# Altium project ArDINo SSR OUTPUT OPTICAL INPUT.PrjPCB
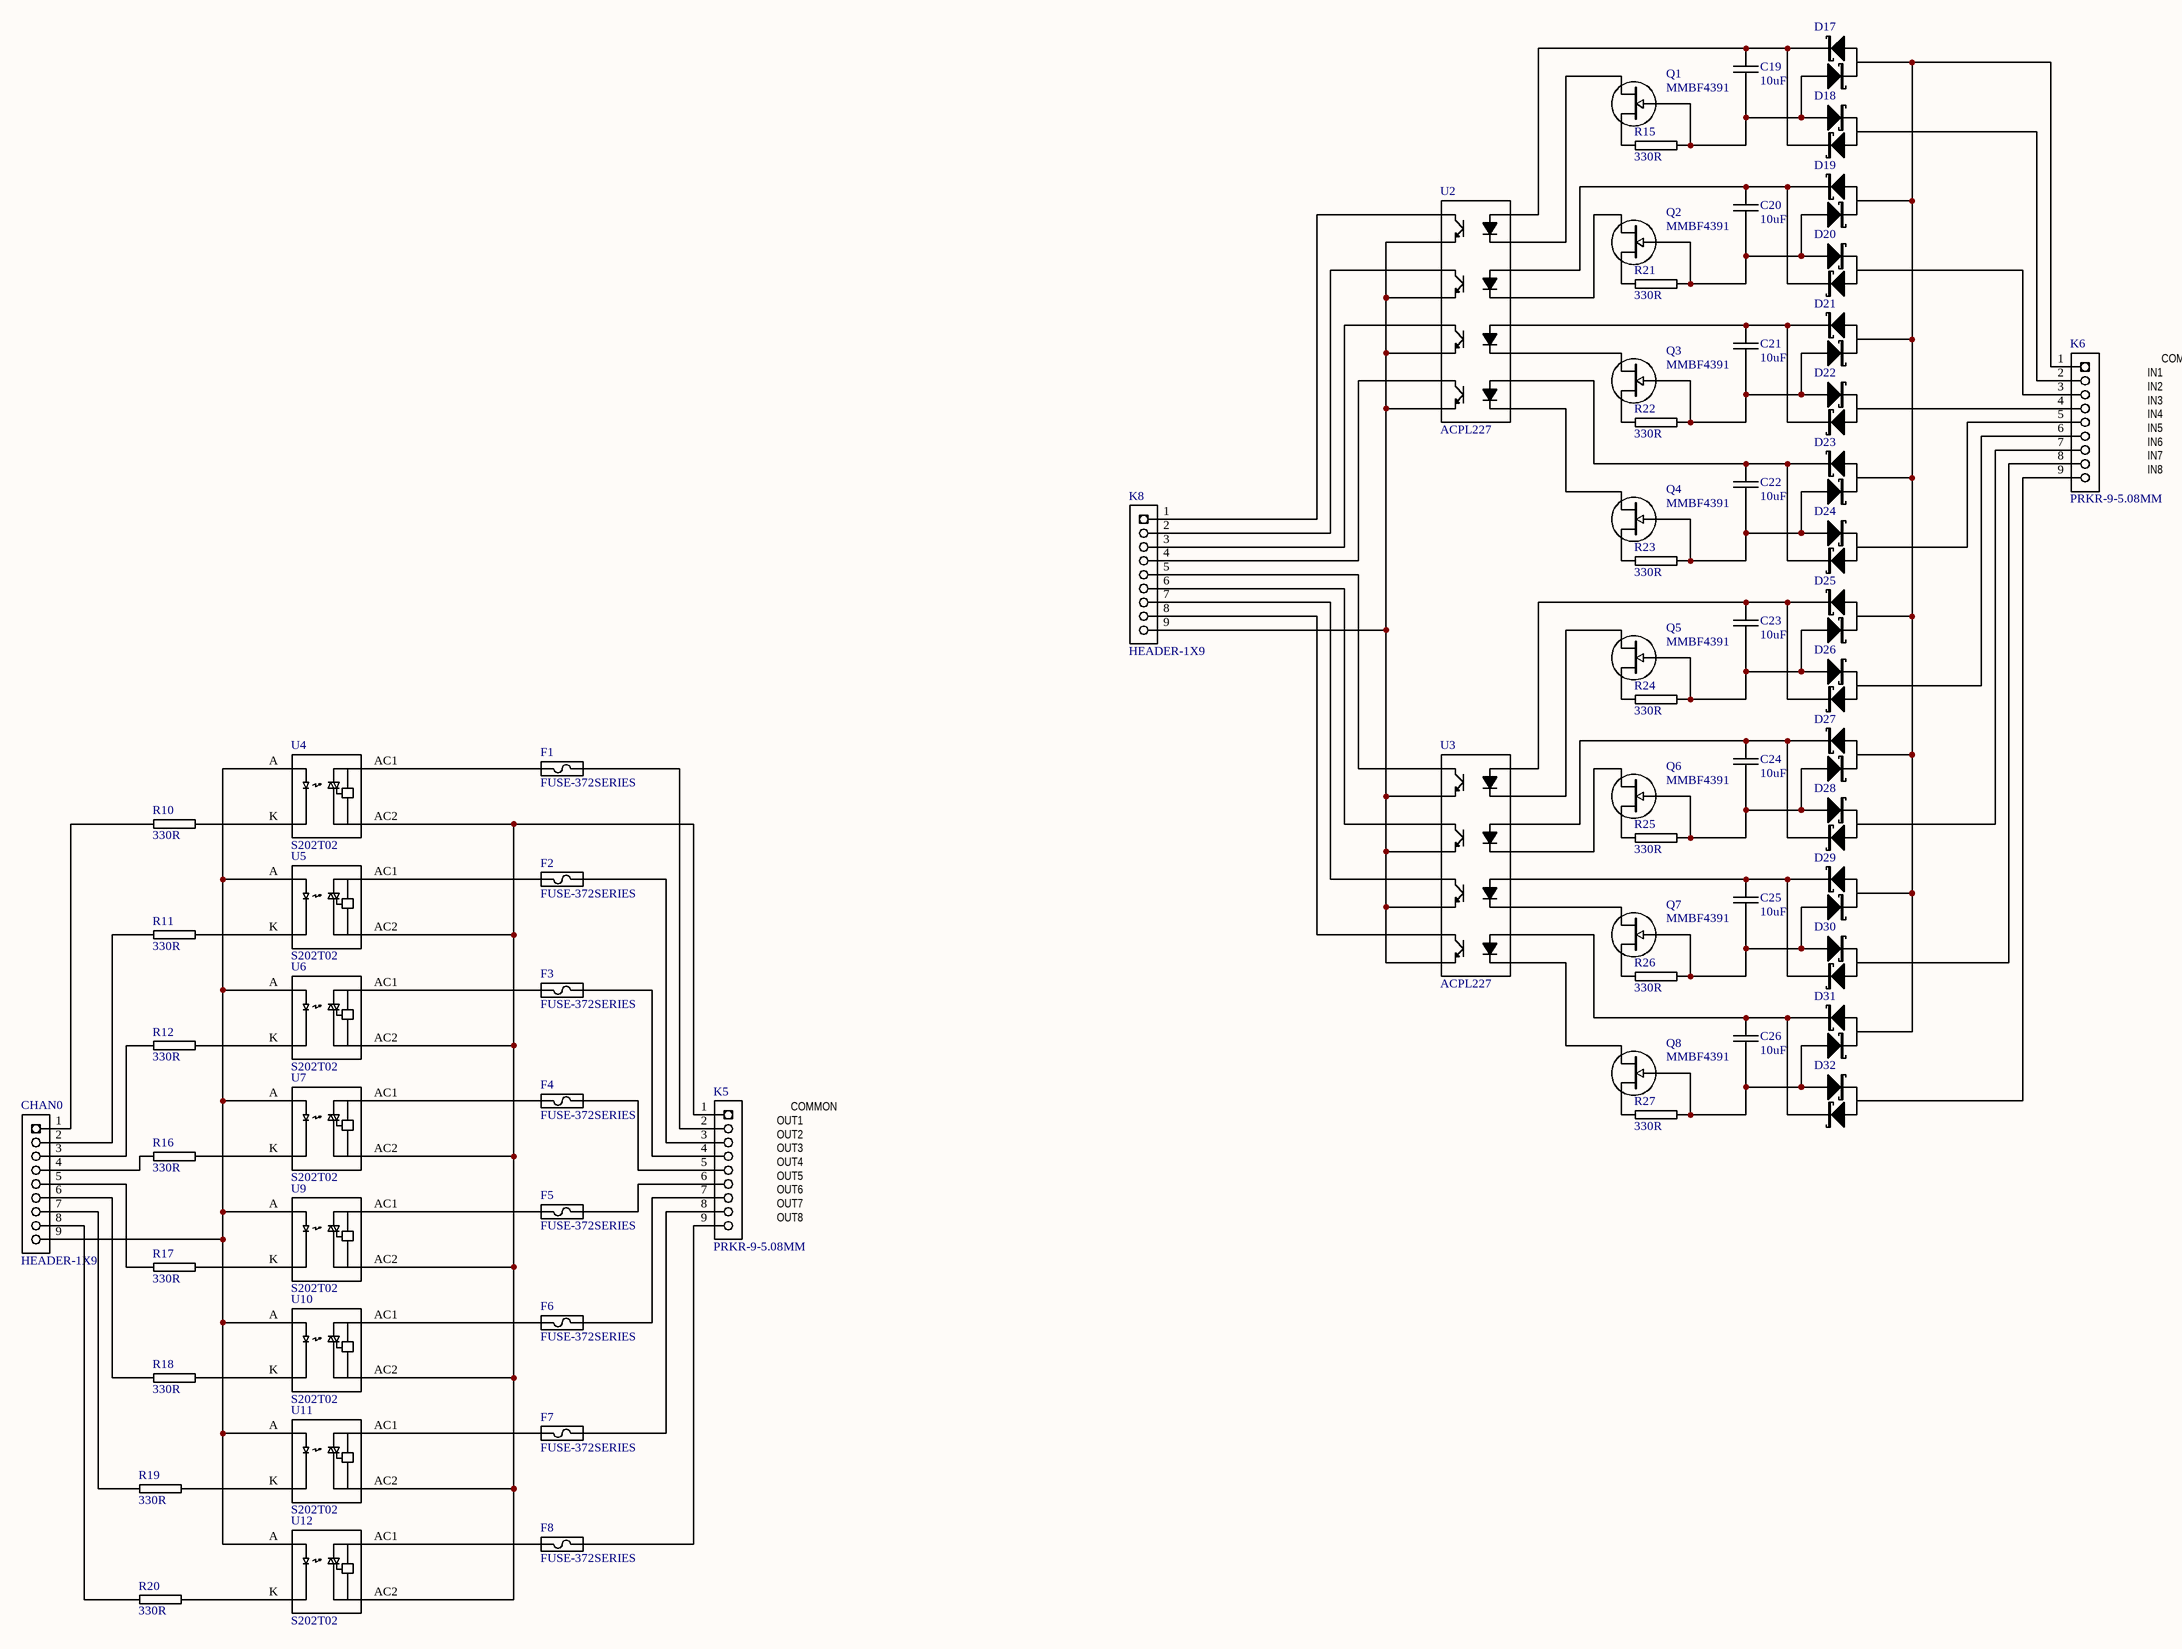
[diagram p0: SSR IO INTERFACE.SchDoc]
1 sheet, 70 parts. Net scope: global (net labels, ports and power ports of the same name join across sheets).
Board file: SSR IO INTERFACE.PcbDoc

## Sheet SSR IO INTERFACE.SchDoc: document title
size C; ApprovedBy: Vincent Himpe; CheckedBy: Vincent Himpe; Author: Vincent Himpe; CompanyName: STMicroelectronics; DrawnBy: Vincent Himpe; Organization: BCD Application; Address1: 2525 Augustine Drive; Address2: Santa Clara 95054 CA; Address3: USA; Revision: A; Project: Project title; DrawnByContact: +1 (408) 451 8116; DrawnByEmail: vincent.himpe@st.com

### Parts
C19  10uF  [1210C-GENERIC]
C20  10uF  [1210C-GENERIC]
C21  10uF  [1210C-GENERIC]
C22  10uF  [1210C-GENERIC]
C23  10uF  [1210C-GENERIC]
C24  10uF  [1210C-GENERIC]
C25  10uF  [1210C-GENERIC]
C26  10uF  [1210C-GENERIC]
CHAN0  HEADER-1X9  [HEADER-1X9]
D17  BAT54S-SOT23  [SOT23-123]  (value not drawn)
D18  BAT54S-SOT23  [SOT23-123]  (value not drawn)
D19  BAT54S-SOT23  [SOT23-123]  (value not drawn)
D20  BAT54S-SOT23  [SOT23-123]  (value not drawn)
D21  BAT54S-SOT23  [SOT23-123]  (value not drawn)
D22  BAT54S-SOT23  [SOT23-123]  (value not drawn)
D23  BAT54S-SOT23  [SOT23-123]  (value not drawn)
D24  BAT54S-SOT23  [SOT23-123]  (value not drawn)
D25  BAT54S-SOT23  [SOT23-123]  (value not drawn)
D26  BAT54S-SOT23  [SOT23-123]  (value not drawn)
D27  BAT54S-SOT23  [SOT23-123]  (value not drawn)
D28  BAT54S-SOT23  [SOT23-123]  (value not drawn)
D29  BAT54S-SOT23  [SOT23-123]  (value not drawn)
D30  BAT54S-SOT23  [SOT23-123]  (value not drawn)
D31  BAT54S-SOT23  [SOT23-123]  (value not drawn)
D32  BAT54S-SOT23  [SOT23-123]  (value not drawn)
F1  FUSE-372SERIES  [FUSE-372]
F2  FUSE-372SERIES  [FUSE-372]
F3  FUSE-372SERIES  [FUSE-372]
F4  FUSE-372SERIES  [FUSE-372]
F5  FUSE-372SERIES  [FUSE-372]
F6  FUSE-372SERIES  [FUSE-372]
F7  FUSE-372SERIES  [FUSE-372]
F8  FUSE-372SERIES  [FUSE-372]
K5  PRKR-9-5.08MM  [PRKR-9-5.08MM]
K6  PRKR-9-5.08MM  [PRKR-9-5.08MM]
K8  HEADER-1X9  [HEADER-1X9]
Q1  MMBF4391  [SOT23-DSG]
Q2  MMBF4391  [SOT23-DSG]
Q3  MMBF4391  [SOT23-DSG]
Q4  MMBF4391  [SOT23-DSG]
Q5  MMBF4391  [SOT23-DSG]
Q6  MMBF4391  [SOT23-DSG]
Q7  MMBF4391  [SOT23-DSG]
Q8  MMBF4391  [SOT23-DSG]
R10  330R  [0805R-330]
R11  330R  [0805R-330]
R12  330R  [0805R-330]
R15  330R  [0805R-330]
R16  330R  [0805R-330]
R17  330R  [0805R-330]
R18  330R  [0805R-330]
R19  330R  [0805R-330]
R20  330R  [0805R-330]
R21  330R  [0805R-330]
R22  330R  [0805R-330]
R23  330R  [0805R-330]
R24  330R  [0805R-330]
R25  330R  [0805R-330]
R26  330R  [0805R-330]
R27  330R  [0805R-330]
U2  ACPL227  [SO16]
U3  ACPL227  [SO16]
U4  S202T02  [S202T02]
U5  S202T02  [S202T02]
U6  S202T02  [S202T02]
U7  S202T02  [S202T02]
U9  S202T02  [S202T02]
U10  S202T02  [S202T02]
U11  S202T02  [S202T02]
U12  S202T02  [S202T02]

### Nets
NetC19_1: C19.1 D17.2 D18.2 U2.1(A1)
NetC19_2: C19.2 D17.1 D18.1 Q1.G R15.2
NetC20_1: C20.1 D19.2 D20.2 U2.3(A2)
NetC20_2: C20.2 D19.1 D20.1 Q2.G R21.2
NetC21_1: C21.1 D21.2 D22.2 U2.5(A3)
NetC21_2: C21.2 D21.1 D22.1 Q3.G R22.2
NetC22_1: C22.1 D23.2 D24.2 U2.7(A4)
NetC22_2: C22.2 D23.1 D24.1 Q4.G R23.2
NetC23_1: C23.1 D25.2 D26.2 U3.1(A1)
NetC23_2: C23.2 D25.1 D26.1 Q5.G R24.2
NetC24_1: C24.1 D27.2 D28.2 U3.3(A2)
NetC24_2: C24.2 D27.1 D28.1 Q6.G R25.2
NetC25_1: C25.1 D29.2 D30.2 U3.5(A3)
NetC25_2: C25.2 D29.1 D30.1 Q7.G R26.2
NetC26_1: C26.1 D31.2 D32.2 U3.7(A4)
NetC26_2: C26.2 D31.1 D32.1 Q8.G R27.2
NetCHAN0_1: CHAN0.1 R10.1
NetCHAN0_2: CHAN0.2 R11.1
NetCHAN0_3: CHAN0.3 R12.1
NetCHAN0_4: CHAN0.4 R16.1
NetCHAN0_5: CHAN0.5 R17.1
NetCHAN0_6: CHAN0.6 R18.1
NetCHAN0_7: CHAN0.7 R19.1
NetCHAN0_8: CHAN0.8 R20.1
NetCHAN0_9: CHAN0.9 U4.A U5.A U6.A U7.A U9.A U10.A U11.A U12.A
NetD17_3: D17.3 D19.3 D21.3 D23.3 D25.3 D27.3 D29.3 D31.3 K6.1
NetD18_3: D18.3 K6.2
NetD20_3: D20.3 K6.3
NetD22_3: D22.3 K6.4
NetD24_3: D24.3 K6.5
NetD26_3: D26.3 K6.6
NetD28_3: D28.3 K6.7
NetD30_3: D30.3 K6.8
NetD32_3: D32.3 K6.9
NetF1_1: F1.1 K5.2
NetF1_2: F1.2 U4.AC1
NetF2_1: F2.1 K5.3
NetF2_2: F2.2 U5.AC1
NetF3_1: F3.1 K5.4
NetF3_2: F3.2 U6.AC1
NetF4_1: F4.1 K5.5
NetF4_2: F4.2 U7.AC1
NetF5_1: F5.1 K5.6
NetF5_2: F5.2 U9.AC1
NetF6_1: F6.1 K5.7
NetF6_2: F6.2 U10.AC1
NetF7_1: F7.1 K5.8
NetF7_2: F7.2 U11.AC1
NetF8_1: F8.1 K5.9
NetF8_2: F8.2 U12.AC1
NetK5_1: K5.1 U4.AC2 U5.AC2 U6.AC2 U7.AC2 U9.AC2 U10.AC2 U11.AC2 U12.AC2
NetK8_1: K8.1 U2.16(C1)
NetK8_2: K8.2 U2.14(C2)
NetK8_3: K8.3 U2.12(C3)
NetK8_4: K8.4 U2.10(C4)
NetK8_5: K8.5 U3.16(C1)
NetK8_6: K8.6 U3.14(C2)
NetK8_7: K8.7 U3.12(C3)
NetK8_8: K8.8 U3.10(C4)
NetK8_9: K8.9 U2.9(E4) U2.11(E3) U2.13(E2) U2.15(E1) U3.9(E4) U3.11(E3) U3.13(E2) U3.15(E1)
NetQ1_D: Q1.D U2.2(K1)
NetQ1_S: Q1.S R15.1
NetQ2_D: Q2.D U2.4(K2)
NetQ2_S: Q2.S R21.1
NetQ3_D: Q3.D U2.6(K3)
NetQ3_S: Q3.S R22.1
NetQ4_D: Q4.D U2.8(K4)
NetQ4_S: Q4.S R23.1
NetQ5_D: Q5.D U3.2(K1)
NetQ5_S: Q5.S R24.1
NetQ6_D: Q6.D U3.4(K2)
NetQ6_S: Q6.S R25.1
NetQ7_D: Q7.D U3.6(K3)
NetQ7_S: Q7.S R26.1
NetQ8_D: Q8.D U3.8(K4)
NetQ8_S: Q8.S R27.1
NetR10_2: R10.2 U4.K
NetR11_2: R11.2 U5.K
NetR12_2: R12.2 U6.K
NetR16_2: R16.2 U7.K
NetR17_2: R17.2 U9.K
NetR18_2: R18.2 U10.K
NetR19_2: R19.2 U11.K
NetR20_2: R20.2 U12.K

### Notes on the sheet
- (near K6) IN1
- (near K6) IN2
- (near K6) IN3
- (near K6) COMMON
- (near K6) IN4
- (near K6) IN5
- (near K6) IN6
- (near K6) IN7
- (near K6) IN8
- (near K5) OUT1
- (near K5) OUT2
- (near K5) OUT3
- (near K5) OUT4
- (near K5) COMMON
- (near K5) OUT5
- (near K5) OUT6
- (near K5) OUT7
- (near K5) OUT8
- PROJECT
- STMicroelectronics
- Last Modified
- Sheet
- of
- Document
- Revision
- Drawn By
- Information in this document is the intellectual property of STMicroelectronics.Disclosure outside of STMicroelectronics is prohibited without prior written approval. Contents may be subject to Patent or Patent application.
- 2525 Augustine Drive
- Santa Clara 95054 CA
- USA

### Library data of the parts
C19-C26 = 1210C-10UF-50V-TDK: GENERIC CAPACITOR NON POLARISED 1210; REEL: C87; Supplier 1: Digi-Key; Supplier Part Number 1: 445-4537-2-ND
D17-D32 = BAT54S-SOT23: DUAL SCHOTTKY DIODE SERIES; Manufacturer Part Number: BAT54S,215; Manufacturer: NXP Semiconductors; Voltage - DC Reverse (Vr) (Max): 30V; Speed: Small Signal =< 200mA (Io), Any Speed; Current - Reverse Leakage @ Vr: 2µA @ 25V; Diode Configuration: 1 Pair Series Connection; Voltage - Forward (Vf) (Max) @ If: 800mV @ 100mA; Current - Average Rectified (Io) (per Diode): 200mA (DC); Reverse Recovery Time (trr): 5ns; Description: DIODE SCHOTTKY 30V DUAL SOT23; Supplier 1: Digi-Key; Supplier Part Number 1: 568-1614-1-ND; Diode Type: Schottky; Package / Case: SOT-23-3, TO-236-3, Micro3™, SSD3, SST3; Packaging: Cut Tape (CT); Mounting Type: Surface Mount; Supplier Part Number: 568-1614-1-ND; RoHS: RoHS Compliant; Supplier: Digi-Key; Category: Discrete Semiconductor Products
F1-F8 = FUSE-372SERIES: FUSE-372
R10-R12 R15-R27 = 0805R-330: RESISTOR 0805 1/4 WATT THIN FILM; Reel: *
U2 U3 = ACPL227: QUAD OPTOCOUPLER; Supplier 1: Mouser; Supplier Part Number 1: 630-ACPL-227-50BE
CHAN0 K8 = HEADER-1X9: Supplier 1: Digi-Key; Supplier Part Number 1: S1011E-36-ND
K5 K6 = PRKR-9-5.08MM: Supplier 1: Digi-Key; Supplier Part Number 1: S1011E-36-ND
Q1-Q8 = MMBF4391: Supplier 1: Digi-Key; Supplier Part Number 1: MMBF4391LT1OSCT-ND
U4-U7 U9-U12 = S202T02: Supplier 1: Digi-Key; Supplier Part Number 1: 425-2374-5-ND